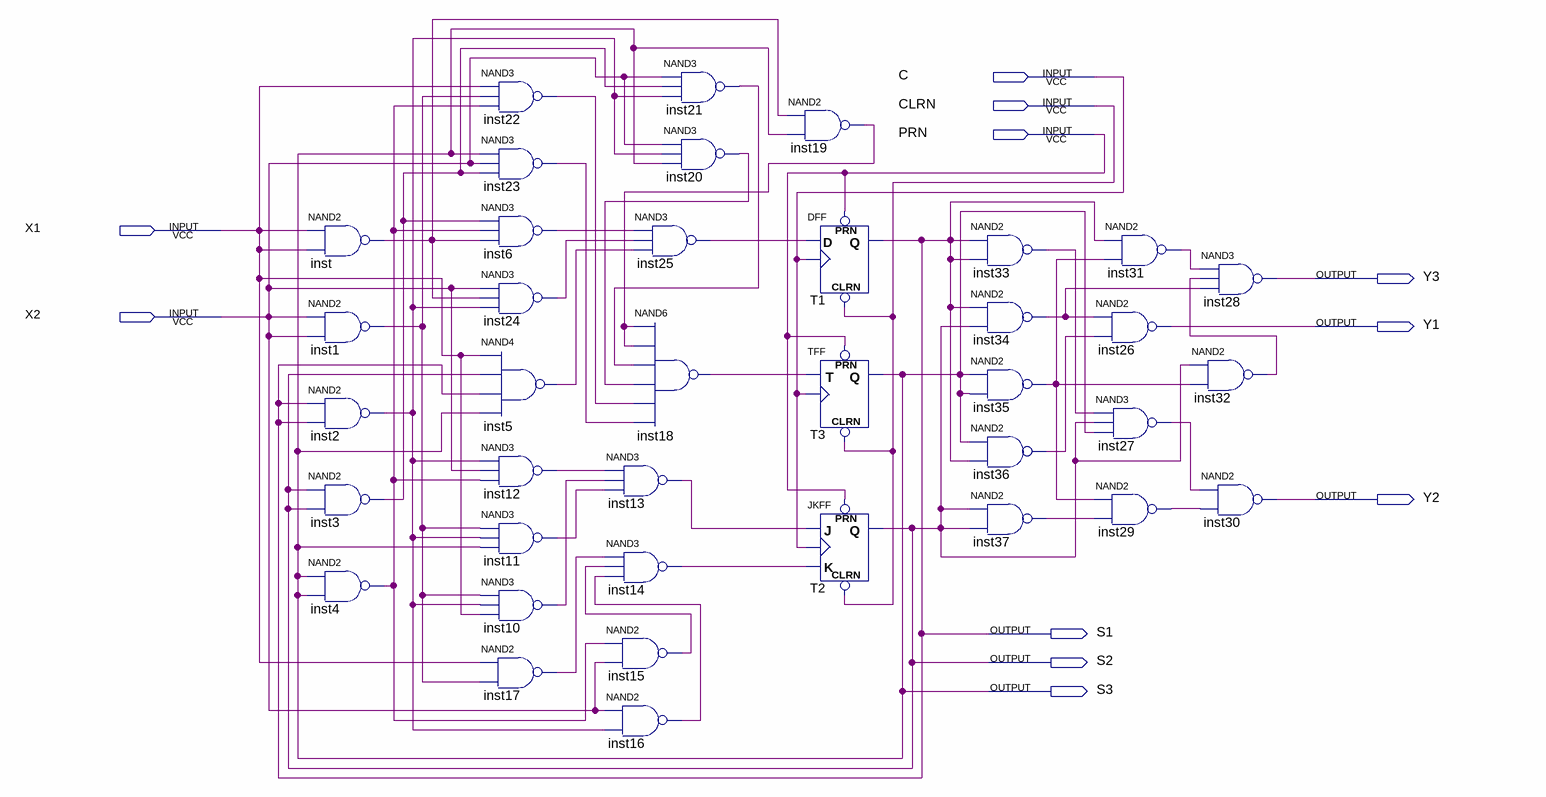
[diagram p0: schematic sheet]
// Quartus schematic MooreMachine.bdf as structural Verilog: 38 symbols, 11 pins
module MooreMachine (
  input  C,
  input  CLRN,
  input  PRN,
  input  X1,
  input  X2,
  output Y3,
  output Y1,
  output Y2,
  output S1,
  output S2,
  output S3
);

  wire inst1_out, inst2_out, inst3_out, inst4_out, inst5_out, inst6_out, inst10_out, inst11_out, inst12_out,
       inst13_out, inst14_out, inst15_out, inst16_out, inst17_out, inst18_out, inst19_out, inst20_out,
       inst21_out, inst22_out, inst23_out, inst24_out, inst25_out, inst27_out, inst29_out, inst31_out,
       inst32_out, inst33_out, inst34_out, inst35_out, inst36_out, inst37_out, inst_out;

  nand inst (inst_out, X1, X1);
  nand inst1 (inst1_out, X2, X2);
  nand inst2 (inst2_out, S1, S1);
  nand inst3 (inst3_out, S2, S2);
  nand inst4 (inst4_out, S3, S3);
  nand inst22 (inst22_out, X1, inst1_out, inst4_out);
  nand inst23 (inst23_out, S3, X2, inst3_out);
  nand inst6 (inst6_out, inst3_out, inst4_out, inst_out);
  nand inst24 (inst24_out, X2, inst_out, inst2_out);
  nand inst5 (inst5_out, X1, S2, S1, S3);
  nand inst12 (inst12_out, inst2_out, X2, inst4_out);
  nand inst11 (inst11_out, inst1_out, inst2_out, S3);
  nand inst10 (inst10_out, inst1_out, inst2_out, X1);
  nand inst17 (inst17_out, X1, inst1_out);
  nand inst21 (inst21_out, X2, inst3_out, inst2_out);
  nand inst20 (inst20_out, X2, inst2_out, S3);
  nand inst25 (inst25_out, inst6_out, inst24_out, inst5_out);
  nand inst18 (inst18_out, inst19_out, inst19_out, inst21_out, inst20_out, inst22_out, inst23_out);
  nand inst13 (inst13_out, inst12_out, inst10_out, inst11_out);
  nand inst14 (inst14_out, inst17_out, inst15_out, inst16_out);
  nand inst15 (inst15_out, inst4_out, X2);
  nand inst16 (inst16_out, X2, inst2_out);
  nand inst19 (inst19_out, inst_out, S3);
  DFF T1 (.CLRN(CLRN), .CLK(C), .D(inst25_out), .PRN(PRN), .Q(S1));
  TFF T3 (.PRN(PRN), .CLRN(CLRN), .T(inst18_out), .CLK(C), .Q(S3));
  JKFF T2 (.PRN(PRN), .CLRN(CLRN), .K(inst14_out), .J(inst13_out), .CLK(C), .Q(S2));
  nand inst33 (inst33_out, S1, S1);
  nand inst34 (inst34_out, S1, S2);
  nand inst35 (inst35_out, S3, S3);
  nand inst36 (inst36_out, S3, S1);
  nand inst37 (inst37_out, S2, S2);
  nand inst31 (inst31_out, S1, inst35_out);
  nand inst26 (Y1, inst34_out, inst36_out);
  nand inst27 (inst27_out, inst33_out, S2, S3);
  nand inst29 (inst29_out, inst35_out, inst37_out);
  nand inst28 (Y3, inst31_out, inst32_out, inst34_out);
  nand inst32 (inst32_out, S2, inst35_out);
  nand inst30 (Y2, inst27_out, inst29_out);
endmodule
